# EAGLE design lightpowersupply (EAGLE 9.0.0)
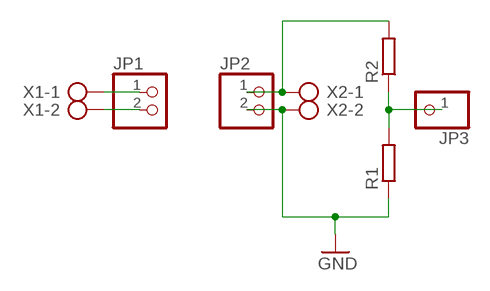
[diagram p0: schematic, sheet 1]

## Parts
JP1  PINHD-1X2  [1X02]
JP2  PINHD-1X2  [1X02]
JP3  PINHD-1X1  [1X01]
R1  R-EU_R1206  [R1206]
R2  R-EU_R1206  [R1206]
X1  AK300/2  [AK300/2]
X2  AK300/2  [AK300/2]

## Nets
GND: JP2.2 R1.1 X2.2
N$1: JP1.1 X1.1
N$2: JP1.2 X1.2
N$4: JP2.1 R2.2 X2.1
N$5: JP3.1 R1.2 R2.1

## Library data of the parts
JP1 JP2 = pinhead:PINHD-1X2: PIN HEADER
JP3 = pinhead:PINHD-1X1: PIN HEADER
R1 R2 = rcl:R-EU_: RESISTOR, European symbol; SPICEPREFIX: R
X1 X2 = con-ptr500:AK300/2: CONNECTOR; OC_FARNELL: unknown; OC_NEWARK: unknown

## Board
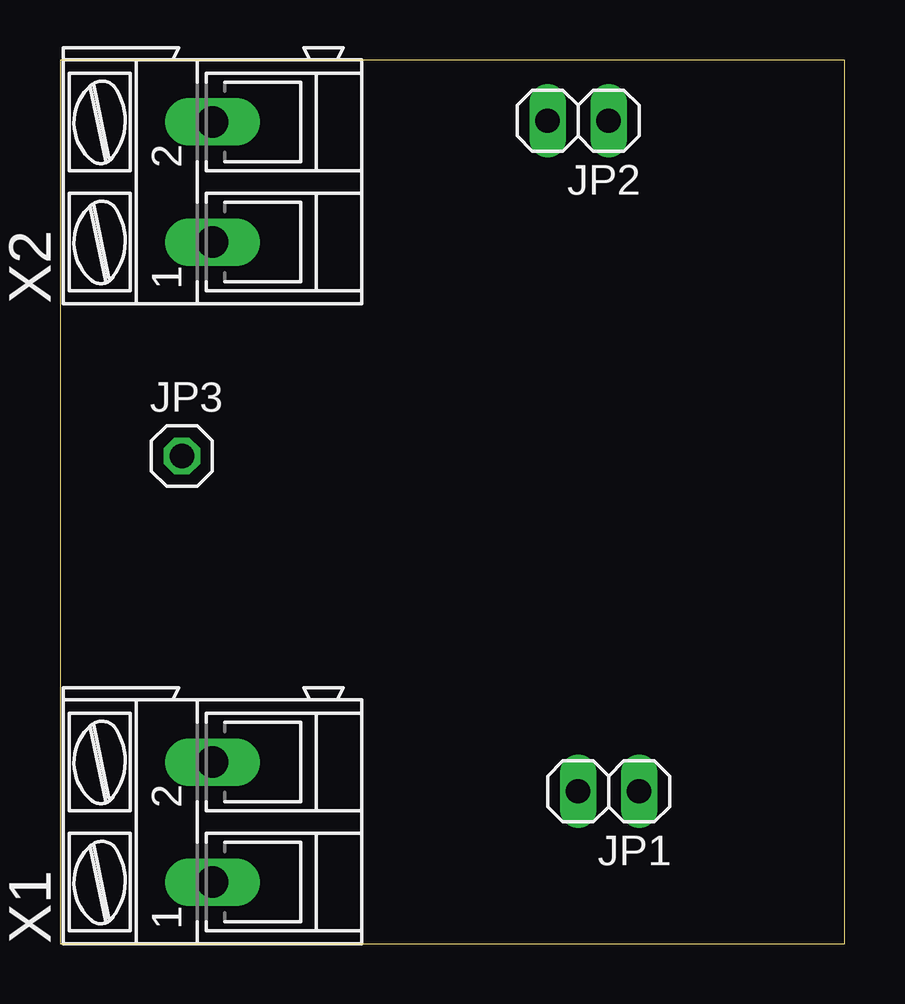
[diagram p1: board, top side]
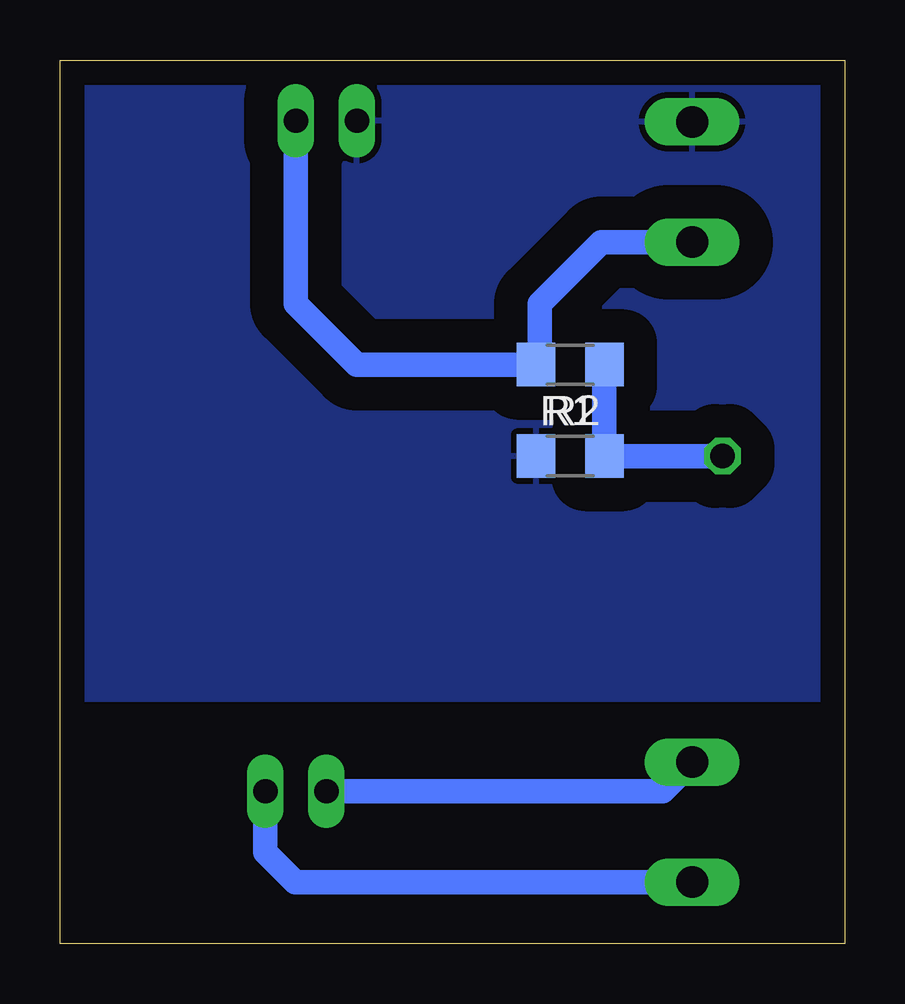
[diagram p2: board, bottom side, seen from below]

Size 32.69 x 36.82 mm. Coordinates in mm from the lower left corner, seen from the top.
Outline: 0,0 32.69,0 32.69,36.82 0,36.82 0,0
Copper layers (1*16): Top 0.035mm / dielectric 1.5mm / Bottom 0.035mm
Design rules "default *": minimum track width 6mil, minimum drill 0.35mm, track to track 1.4mm, track to pad 1.4mm, pad to pad 6mil, via to via 6mil, smd to smd 6mil, copper to edge 40mil, drill to drill 6mil, minimum pad ring 10mil, minimum via ring 8mil, stop-mask expansion 4mil, vias tented up to drill 0mil, thermal gap 10mil

### Footprints (pad centres in the part's own frame; a part is rotated, then mirrored left to right if it is on the bottom)
1X02 = drill 1.016 long: 1 -1.27,0; 2 1.27,0
1X01 = drill 1.016 octagon: 1 0,0
R1206 = smd 1.6 x 1.803: 1 -1.422,0; 2 1.422,0
AK300/2 = drill 1.321 long: 1 -2.515,0; 2 2.489,0

### Placement (x,y rotation side)
JP1  22.86,6.35 180 top
JP2  21.59,34.29 180 top
JP3  5.08,20.32 0 top
R1  11.43,20.32 0 bottom
R2  11.43,24.13 180 bottom
X1  6.35,5.08 90 top
X2  6.35,31.75 90 top

### Tracks (layer width: path | path; a pad name or v marks a point on that pad's centre or on a via)
GND
  pour Bottom: 0,10.16 33.02,10.16 33.02,36.83 0,36.83
N$1
  Bottom 1.016: X1.1 22.89,2.56 24.13,3.81 JP1.1
N$2
  Bottom 1.016: JP1.2 7.57,6.35 X1.2
N$4
  Bottom 1.016: JP2.1 22.86,26.67 20.32,24.13 R2.2 12.7,24.28 12.7,26.67 10.13,29.23 X2.1
N$5
  Bottom 1.016: JP3.1 R1.2 R2.1